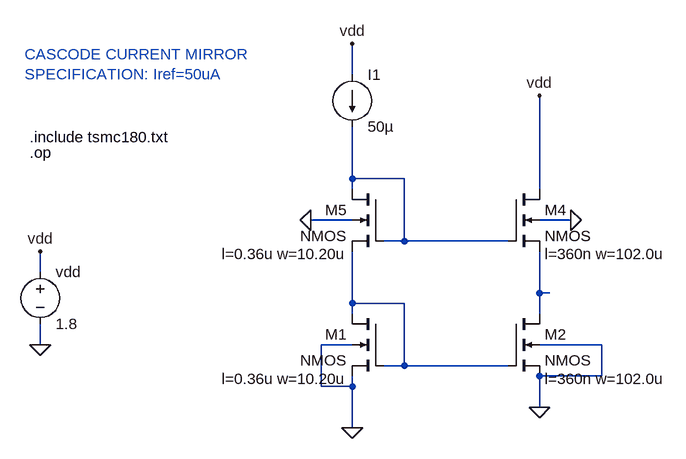
[diagram p0: schematic CurrentMirrorSimple -1cascode.asc]
CurrentMirrorSimple -1cascode.asc, the LTspice schematic file:
Version 4
SHEET 1 880 680
WIRE 80 -144 80 -192
WIRE 80 16 80 -64
WIRE 160 16 80 16
WIRE 80 32 80 16
WIRE 368 32 368 -112
WIRE 80 80 16 80
WIRE 416 80 368 80
WIRE 160 112 160 16
WIRE 160 112 128 112
WIRE 320 112 160 112
WIRE -400 160 -400 128
WIRE 368 192 368 128
WIRE 384 192 368 192
WIRE 80 208 80 128
WIRE 160 208 80 208
WIRE 80 224 80 208
WIRE 368 224 368 192
WIRE -400 272 -400 240
WIRE 80 272 32 272
WIRE 464 272 368 272
WIRE 160 304 160 208
WIRE 160 304 128 304
WIRE 320 304 160 304
WIRE 464 320 464 272
WIRE 464 320 368 320
WIRE 32 336 32 272
WIRE 80 336 80 320
WIRE 80 336 32 336
WIRE 368 368 368 320
WIRE 80 400 80 336
FLAG 80 400 0
FLAG -400 272 0
FLAG -400 128 vdd
FLAG 80 -192 vdd
FLAG 368 368 0
FLAG 368 -112 vdd
FLAG 416 80 0
FLAG 16 80 0
DATAFLAG 96 208 ""
DATAFLAG 96 16 ""
DATAFLAG 288 112 ""
DATAFLAG 384 192 ""
SYMBOL nmos4 128 224 M0
WINDOW 123 56 100 Left 2
SYMATTR Value2 l=0.36u w=10.20u
SYMATTR InstName M1
SYMBOL voltage -400 144 R0
WINDOW 123 0 0 Left 0
WINDOW 39 0 0 Left 0
SYMATTR InstName vdd
SYMATTR Value 1.8
SYMBOL nmos4 320 224 R0
WINDOW 123 56 100 Left 2
SYMATTR Value2 l=360n w=102.0u
SYMATTR InstName M2
SYMBOL nmos4 320 32 R0
WINDOW 123 56 100 Left 2
SYMATTR Value2 l=360n w=102.0u
SYMATTR InstName M4
SYMBOL nmos4 128 32 M0
WINDOW 123 56 100 Left 2
SYMATTR Value2 l=0.36u w=10.20u
SYMATTR InstName M5
SYMBOL current 80 -144 R0
WINDOW 123 0 0 Left 0
WINDOW 39 0 0 Left 0
SYMATTR InstName I1
SYMATTR Value 50µ
TEXT -416 -48 Left 2 !.include tsmc180.txt
TEXT -416 -24 Left 2 !.op
TEXT -424 -176 Left 2 ;CASCODE CURRENT MIRROR \nSPECIFICATION: Iref=50uA

The netlist it stands for:
* CurrentMirrorSimple -1cascode.asc
M1 N003 N003 0 0 NMOS l=0.36u w=10.20u
vdd vdd 0 1.8
M2 N002 N003 0 0 NMOS l=360n w=102.0u
M4 vdd N001 N002 0 NMOS l=360n w=102.0u
M5 N001 N001 N003 0 NMOS l=0.36u w=10.20u
I1 vdd N001 50µ
.model NMOS NMOS
.model PMOS PMOS
.lib standard.mos
.include tsmc180.txt
.op
* CASCODE CURRENT MIRROR
* SPECIFICATION: Iref=50uA
.backanno
.end